# Altium schematic sheet sensors.SchDoc
size A4
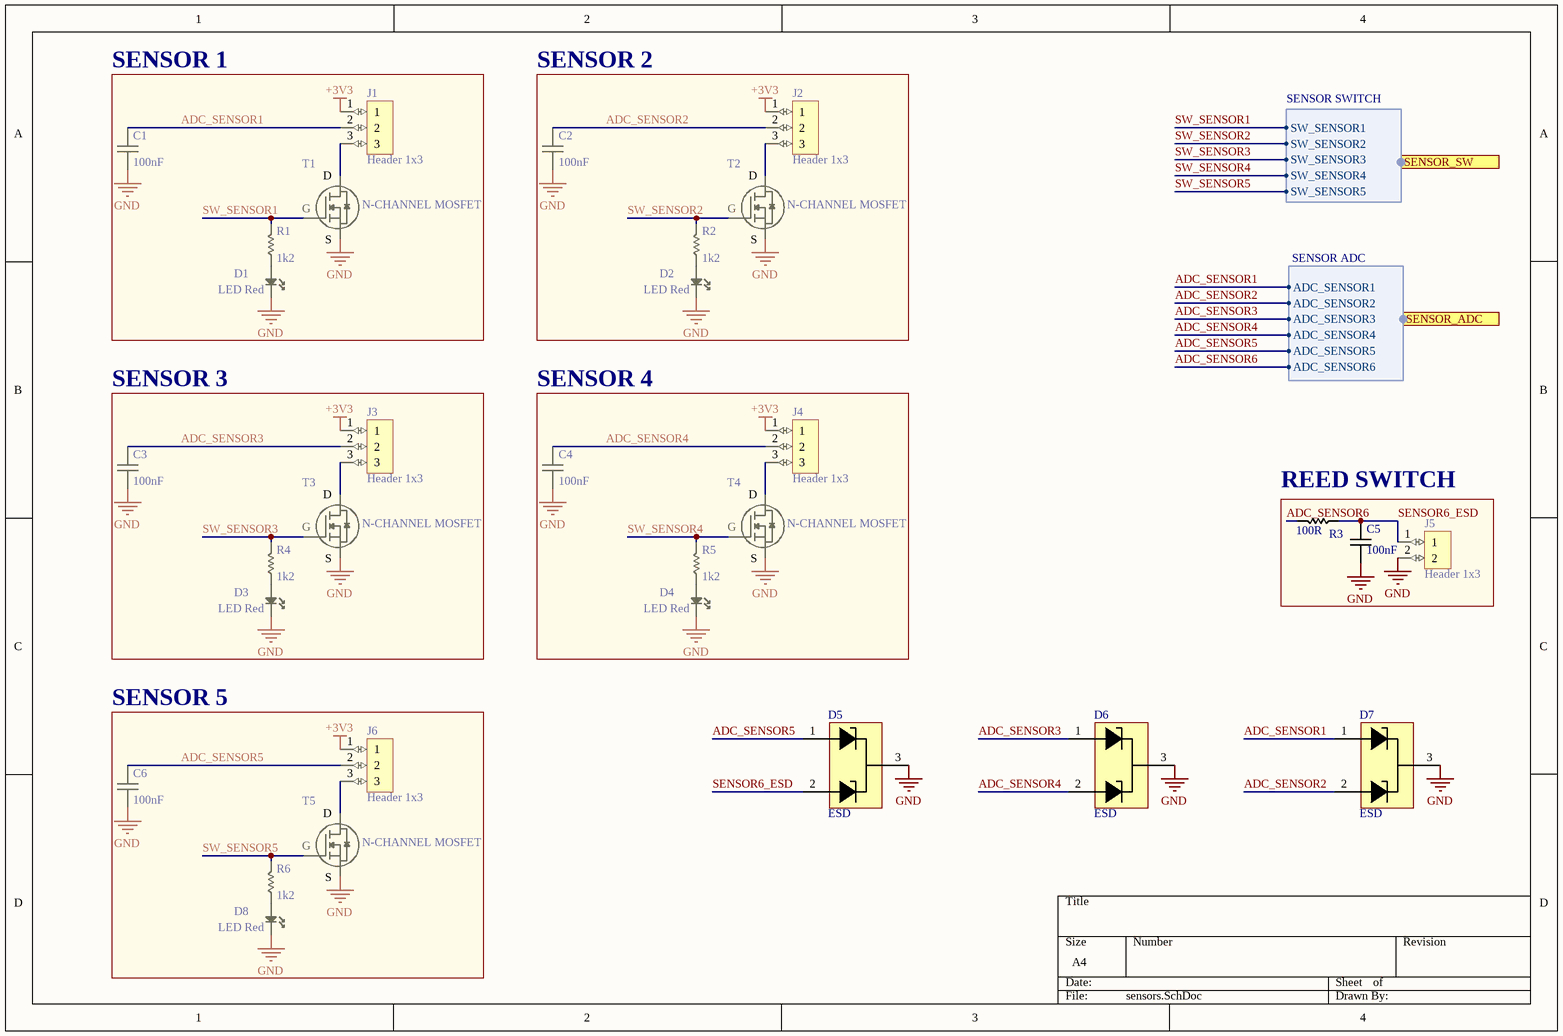
[diagram p0: sensors.SchDoc]

## Parts
C1  value 100nF  [C0402]  (hidden comment: Capacitor 0402)
C2  value 100nF  [C0402]  (hidden comment: Capacitor 0402)
C3  value 100nF  [C0402]  (hidden comment: Capacitor 0402)
C4  value 100nF  [C0402]  (hidden comment: Capacitor 0402)
C5  value 100nF  [C0603]  (hidden comment: Capacitor 0603)
C6  value 100nF  [C0402]  (hidden comment: Capacitor 0402)
D1  LED Red  [L0603 RED]
D2  LED Red  [L0603 RED]
D3  LED Red  [L0603 RED]
D4  LED Red  [L0603 RED]
D5  ESD  [ESD protection]
D6  ESD  [ESD protection]
D7  ESD  [ESD protection]
D8  LED Red  [L0603 RED]
J1  Header 1x3  [Header 1x3 Male JST]
J2  Header 1x3  [Header 1x3 Male JST]
J3  Header 1x3  [Header 1x3 Male JST]
J4  Header 1x3  [Header 1x3 Male JST]
J5  Header 1x3  [HEADER 1X2 MALE JST]
J6  Header 1x3  [Header 1x3 Male JST]
R1  value 1k2  [R0603]  (hidden comment: Resistor 0603)
R2  value 1k2  [R0603]  (hidden comment: Resistor 0603)
R3  value 100R  [R0603]  (hidden comment: Resistor 0603)
R4  value 1k2  [R0603]  (hidden comment: Resistor 0603)
R5  value 1k2  [R0603]  (hidden comment: Resistor 0603)
R6  value 1k2  [R0603]  (hidden comment: Resistor 0603)
T1  N-CHANNEL MOSFET  [2N7002]
T2  N-CHANNEL MOSFET  [2N7002]
T3  N-CHANNEL MOSFET  [2N7002]
T4  N-CHANNEL MOSFET  [2N7002]
T5  N-CHANNEL MOSFET  [2N7002]

## Blocks framed on the sheet
SENSOR 1: C1 D1 J1 R1 T1
SENSOR 2: C2 D2 J2 R2 T2
SENSOR 3: C3 D3 J3 R4 T3
SENSOR 4: C4 D4 J4 R5 T4
REED SWITCH: C5 J5 R3
SENSOR 5: C6 D8 J6 R6 T5

## Ports
SENSOR_ADC (harness SENSOR ADC), SENSOR_SW (harness SENSOR SWITCH)

## Harnesses
SENSOR SWITCH: SW_SENSOR1, SW_SENSOR2, SW_SENSOR3, SW_SENSOR4, SW_SENSOR5
SENSOR ADC: ADC_SENSOR1, ADC_SENSOR2, ADC_SENSOR3, ADC_SENSOR4, ADC_SENSOR5, ADC_SENSOR6

## Nets
+3V3: J1.1 J2.1 J3.1 J4.1 J6.1
GND: C1.1 C2.1 C3.1 C4.1 C5.1 C6.1 D1.2 D2.2 D3.2 D4.2 D5.3 D6.3 D7.3 D8.2 J5.2 T1.2(S) T2.2(S) T3.2(S) T4.2(S) T5.2(S)
ADC_SENSOR1: C1.2 D7.1 J1.2 ; port SENSOR_ADC.ADC_SENSOR1
ADC_SENSOR2: C2.2 D7.2 J2.2 ; port SENSOR_ADC.ADC_SENSOR2
ADC_SENSOR3: C3.2 D6.1 J3.2 ; port SENSOR_ADC.ADC_SENSOR3
ADC_SENSOR4: C4.2 D6.2 J4.2 ; port SENSOR_ADC.ADC_SENSOR4
ADC_SENSOR5: C6.2 D5.1 J6.2 ; port SENSOR_ADC.ADC_SENSOR5
ADC_SENSOR6: R3.2 ; port SENSOR_ADC.ADC_SENSOR6
SENSOR6_ESD: C5.2 D5.2 J5.1 R3.1
SW_SENSOR1: R1.2 T1.1(G) ; port SENSOR_SW.SW_SENSOR1
SW_SENSOR2: R2.2 T2.1(G) ; port SENSOR_SW.SW_SENSOR2
SW_SENSOR3: R4.2 T3.1(G) ; port SENSOR_SW.SW_SENSOR3
SW_SENSOR4: R5.2 T4.1(G) ; port SENSOR_SW.SW_SENSOR4
SW_SENSOR5: R6.2 T5.1(G) ; port SENSOR_SW.SW_SENSOR5
NetD1_1: D1.1 R1.1
NetD2_1: D2.1 R2.1
NetD3_1: D3.1 R4.1
NetD4_1: D4.1 R5.1
NetD8_1: D8.1 R6.1
NetJ1_3: J1.3 T1.3(D)
NetJ2_3: J2.3 T2.3(D)
NetJ3_3: J3.3 T3.3(D)
NetJ4_3: J4.3 T4.3(D)
NetJ6_3: J6.3 T5.3(D)

## Library data of the parts
D1-D4 D8 = LED 0603 Red
D5-D7 = ESD protection 3.3V: PESD3V3S2UAT
J1-J4 J6 = Header 1x3 Male
J5 = Header 1x2 Male
T1-T5 = 2N7002